# Altium project 风扇_V1.5.PrjPCB
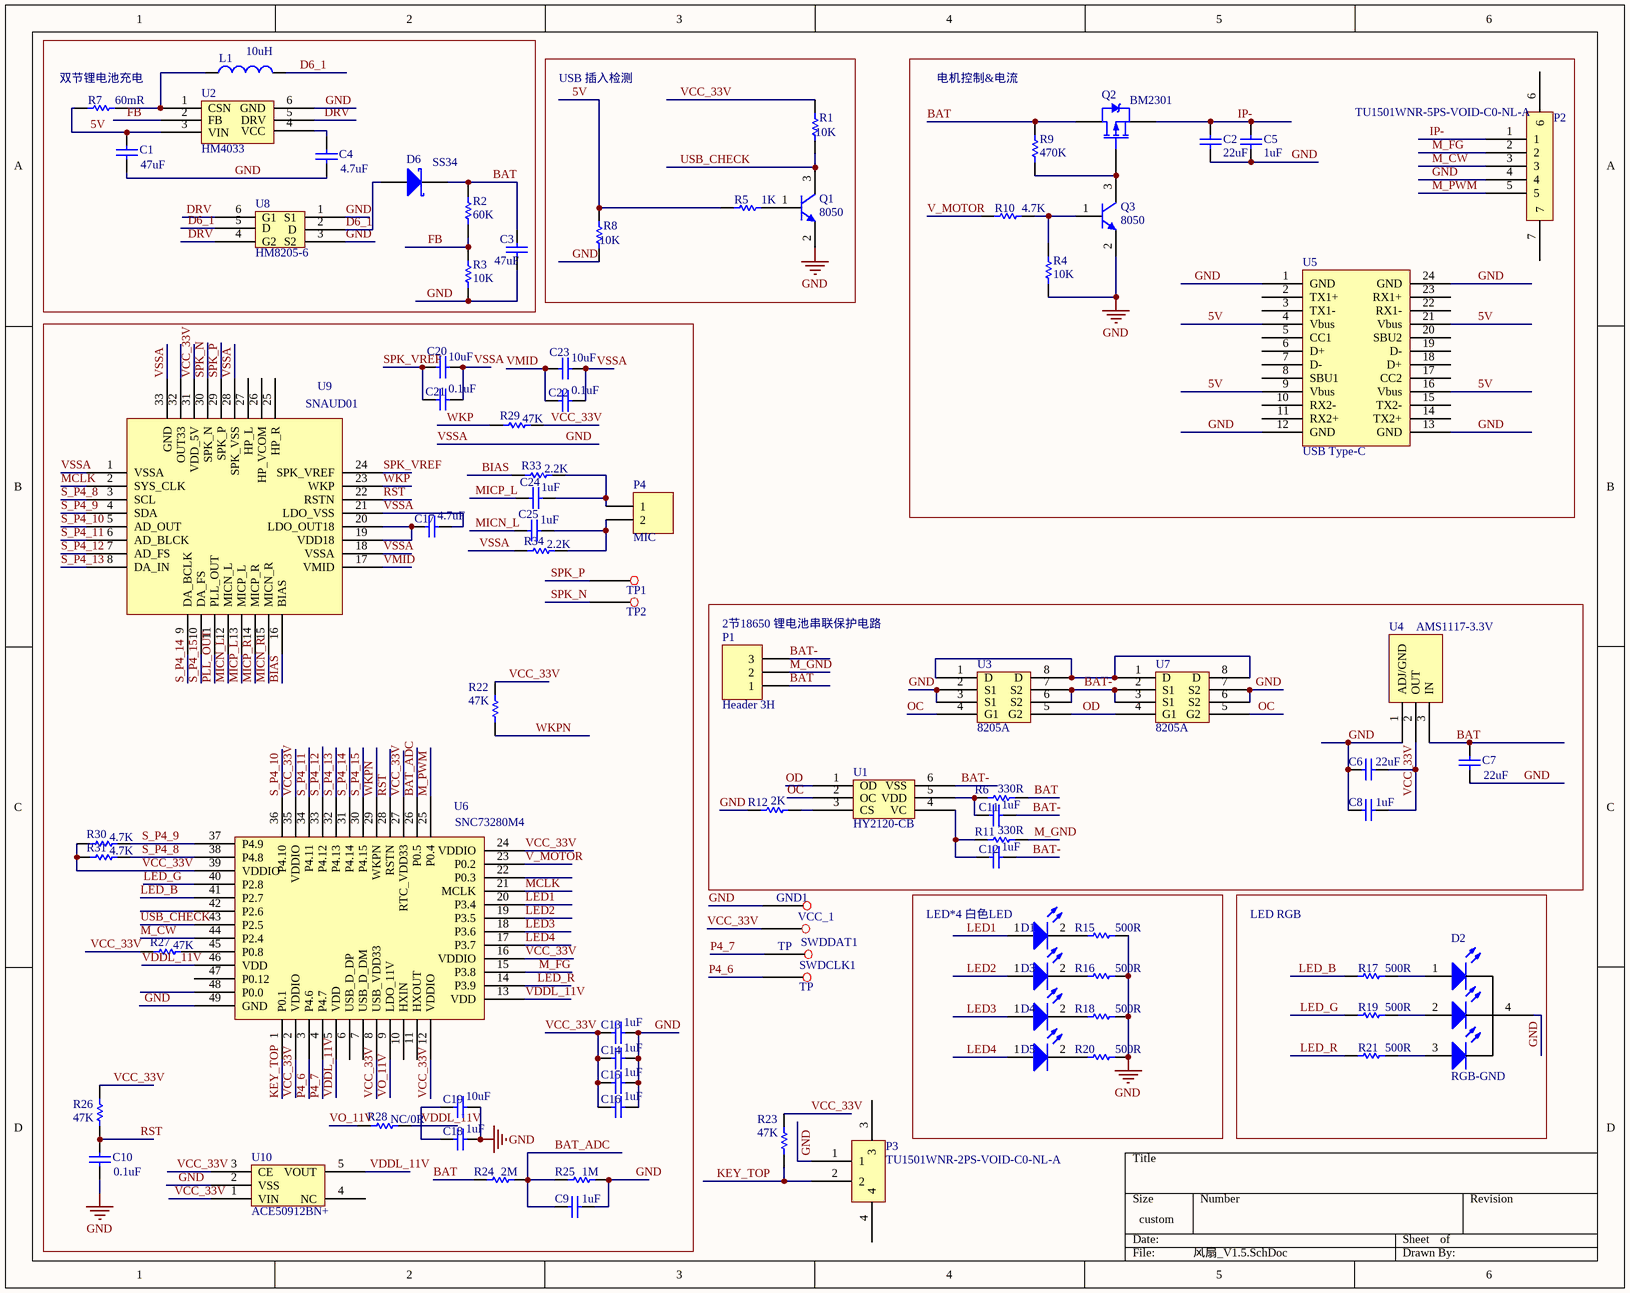
[diagram p0: 风扇_V1.5.SchDoc]
1 sheet, 86 parts. Net scope: global (net labels, ports and power ports of the same name join across sheets).
Board file: 风扇_V1.5.PcbDoc

## Sheet 风扇_V1.5.SchDoc: 风扇-衣架
size 304 x 241 mm

### Parts
C1  47uF  [C-0603]
C2  22uF  [C-0603]
C3  47uF  [C-0603]
C4  4.7uF  [C-0402]
C5  1uF  [C-0402]
C6  22uF  [C-0603]
C7  22uF  [C-0603]
C8  1uF  [C-0402]
C9  1uF  [C-0402]
C10  0.1uF  [C-0402]
C11  1uF  [C-0402]
C12  1uF  [C-0402]
C13  1uF  [C-0402]
C14  1uF  [C-0402]
C15  1uF  [C-0402]
C16  1uF  [C-0402]
C17  4.7uF  [C-0402]
C18  1uF  [C-0402]
C19  10uF  [C-0402]
C20  10uF  [C-0402]
C21  0.1uF  [C-0402]
C22  0.1uF  [C-0402]
C23  10uF  [C-0402]
C24  1uF  [C-0402]
C25  1uF  [C-0402]
D1  LED0  [LED-0603]  (value not drawn)
D2  RGB-GND  [0603*2-LED]
D3  LED0  [LED-0603]  (value not drawn)
D4  LED0  [LED-0603]  (value not drawn)
D5  LED0  [LED-0603]  (value not drawn)
D6  SS34  [DSMD]
GND1  TP  [TP-1.5]  (value not drawn)
L1  10uH  [L-SMD]
P1  Header 3H  [3P-SMT-3*3]
P2  TU1501WNR-5PS-VOID-C0-NL-A  [TU1501WNR-5PS-VOID-*-NL-A]
P3  TU1501WNR-2PS-VOID-C0-NL-A  [TU1501WNR-2PS-VOID-*-NL-A]
P4  MIC  [HDR1X2]
Q1  8050  [SOT-23]
Q2  BM2301  [SOT-23]
Q3  8050  [SOT-23]
R1  10K  [R-0402]
R2  60K  [R-0402]
R3  10K  [R-0402]
R4  10K  [R-0402]
R5  1K  [R-0402]
R6  330R  [R-0402]
R7  60mR  [R-0402]
R8  10K  [R-0402]
R9  470K  [R-0402]
R10  4.7K  [R-0402]
R11  330R  [R-0402]
R12  2K  [R-0402]
R15  500R  [R-0402]
R16  500R  [R-0402]
R17  500R  [R-0402]
R18  500R  [R-0402]
R19  500R  [R-0402]
R20  500R  [R-0402]
R21  500R  [R-0402]
R22  47K  [R-0402]
R23  47K  [R-0402]
R24  2M  [R-0402]
R25  1M  [R-0402]
R26  47K  [R-0402]
R27  47K  [R-0402]
R28  NC/0R  [R-0402]
R29  47K  [R-0402]
R30  4.7K  [R-0402]
R31  4.7K  [R-0402]
R33  2.2K  [R-0402]
R34  2.2K  [R-0402]
SWDCLK1  TP  [TP-1.5]
SWDDAT1  TP  [TP-1.5]
TP1  TP  [TP-1]  (value not drawn)
TP2  TP  [TP-1]  (value not drawn)
U1  HY2120-CB  [SOT-23-6L]
U2  HM4033  [SOT-23-6L]
U3  8205A  [TSSOP8]
U4  AMS1117-3.3V  [SOT-223]
U5  USB Type-C  [USB-type C]
U6  SNC73280M4  [QFN48-7*7]
U7  8205A  [TSSOP8]
U8  HM8205-6  [SOT-23-6L]
U9  SNAUD01  [QFN32_AUDO01]
U10  ACE50912BN+  [SOT-23-5]
VCC_1  TP  [TP-1.5]  (value not drawn)

### Blocks framed on the sheet
双节锂电池充电: C1 C3 C4 D6 L1 R2 R3 R7 U2 U8
USB 插入检测: Q1 R1 R5 R8
电机控制&电流: C2 C5 P2 Q2 Q3 R4 R9 R10 U5
2节18650 锂电池串联保护电路: C6-C8 C11 C12 P1 R6 R11 R12 U1 U3 U4 U7
LED*4 白色LED: D1 D3-D5 R15 R16 R18 R20
LED RGB: D2 R17 R19 R21

### Nets
GND: C1.2 C2.1 C3.1 C4.2 C5.1 C6.1 C7.1 C8.1 C9.1 C10.1 C13.1 C14.1 C15.1 C16.1 C17.1 C18.1 C19.1 C20.1 C21.1 C22.1 C23.1 D2.4 GND1.1 P2.4 P3.1 Q1.2(E) Q3.2(E) R3.2 R4.1 R8.2 R12.1 R15.2 R16.2 R18.2 R20.2 R25.2 R34.2 U2.6(GND) U3.2(S1) U3.3(S1) U4.1(ADJ/GND) U5.1(GND) U5.12(GND) U5.13(GND) U5.24(GND) U6.49(GND) U7.6(S2) U7.7(S2) U8.1(S1) U8.3(S2) U9.1(VSSA) U9.18(VSSA) U9.21(LDO_VSS) U9.28(SPK_VSS) U9.33(GND) U10.2(VSS)  [also labelled VSSA]
5V: C1.1 R5.1 R7.2 R8.1 U2.3(VIN) U5.4(Vbus) U5.9(Vbus) U5.16(Vbus) U5.21(Vbus)
BAT: C3.2 C7.2 D6.1(K) P1.1 Q2.2(D) R2.1 R6.2 R9.2 R24.1 U4.3(IN)
BAT-: C11.1 C12.1 P1.3 U1.6(VSS) U3.6(S2) U3.7(S2) U7.2(S1) U7.3(S1)
BAT_ADC: C9.2 R24.2 R25.1 U6.26(P0.5)
BIAS: R33.2 U9.16(BIAS)
D6_1: D6.3(A) L1.2 U8.2(D) U8.5(D)
DRV: U2.5(DRV) U8.4(G2) U8.6(G1)
FB: R2.2 R3.1 U2.2(FB)
IP-: C2.2 C5.2 P2.1 Q2.3(S)
KEY_TOP: P3.2 R23.1 U6.1(P0.1)
LED1: D1.1(A) U6.20(P3.4)
LED2: D3.1(A) U6.19(P3.5)
LED3: D4.1(A) U6.18(P3.6)
LED4: D5.1(A) U6.17(P3.7)
LED_B: R17.1 U6.41(P2.7)
LED_G: R19.1 U6.40(P2.8)
LED_R: R21.1 U6.14(P3.9)
M_CW: P2.3 U6.44(P2.4)
M_FG: P2.2 U6.15(P3.8)
M_GND: P1.2 R11.2
M_PWM: P2.5 U6.25(P0.4)
MCLK: U6.21(MCLK) U9.2(SYS_CLK)
MICN_L: C25.2 U9.12(MICN_L)
MICN_R: U9.15(MICN_R)
MICP_L: C24.2 U9.13(MICP_L)
MICP_R: U9.14(MICP_R)
OC: U1.2(OC) U3.4(G1) U7.5(G2)
OD: U1.1(OD) U3.5(G2) U7.4(G1)
P4_6: SWDCLK1.1 U6.3(P4.6)
P4_7: SWDDAT1.1 U6.4(P4.7)
PLL_OUT: U9.11(PLL_OUT)
RST: C10.2 R26.1 U6.28(RSTN) U9.22(RSTN)
S_P4_8: R31.1 U6.38(P4.8) U9.3(SCL)
S_P4_9: R30.1 U6.37(P4.9) U9.4(SDA)
S_P4_10: U6.36(P4.10) U9.5(AD_OUT)
S_P4_11: U6.34(P4.11) U9.6(AD_BLCK)
S_P4_12: U6.33(P4.12) U9.7(AD_FS)
S_P4_13: U6.32(P4.13) U9.8(DA_IN)
S_P4_14: U6.31(P4.14) U9.9(DA_BCLK)
S_P4_15: U6.30(P4.15) U9.10(DA_FS)
SPK_N: TP2.?1 U9.30(SPK_N)
SPK_P: TP1.?1 U9.29(SPK_P)
SPK_VREF: C20.2 C21.2 U9.24(SPK_VREF)
USB_CHECK: Q1.3(C) R1.1 U6.43(P2.5)
V_MOTOR: R10.1 U6.23(P0.2)
VCC_33V: C6.2 C8.2 C13.2 C14.2 C15.2 C16.2 R1.2 R22.2 R23.2 R26.2 R27.2 R29.1 R30.2 R31.2 U4.2(OUT) U6.2(VDDIO) U6.8(USB_VDD33) U6.12(VDDIO) U6.16(VDDIO) U6.24(VDDIO) U6.27(RTC_VDD33) U6.35(VDDIO) U6.39(VDDIO) U9.31(VDD_5V) U10.1(VIN) U10.3(CE) VCC_1.1
VDDL_11V: C18.2 C19.2 R28.1 U6.5(VDD) U6.13(VDD) U6.46(VDD) U10.5(VOUT)
VMID: C22.2 C23.2 U9.17(VMID)
VO_11V: R28.2 U6.9(LDO_11V)
WKP: R29.2 U9.23(WKP)
WKPN: R22.1 U6.29(WKPN)
NetC4_1: C4.1 U2.4(VCC)
NetC11_2: C11.2 R6.1 U1.5(VDD)
NetC12_2: C12.2 R11.1 U1.4(VC)
NetC17_2: C17.2 U9.19(VDD18) U9.20(LDO_OUT18)
NetC24_1: C24.1 P4.1 R33.1
NetC25_1: C25.1 P4.2 R34.1
NetD1_2: D1.2(K) R15.1
NetD2_1: D2.1 R17.2
NetD2_2: D2.2 R19.2
NetD2_3: D2.3 R21.2
NetD3_2: D3.2(K) R16.1
NetD4_2: D4.2(K) R18.1
NetD5_2: D5.2(K) R20.1
NetL1_1: L1.1 R7.1 U2.1(CSN)
NetQ1_1: Q1.1(B) R5.2
NetQ2_1: Q2.1(G) Q3.3(C) R9.1
NetQ3_1: Q3.1(B) R4.2 R10.2
NetR12_2: R12.2 U1.3(CS)
NetR27_1: R27.1 U6.45(P0.8)
NetU3_1: U3.1(D) U3.8(D) U7.1(D) U7.8(D)

Not connected (* = marked no-connect by the designer): P2 6 7; P3 3 4; U5 2(TX1+) 3(TX1-) 5(CC1) 6(D+) 7(D-) 8(SBU1) 10(RX2-) 11(RX2+) 14(TX2+) 15(TX2-) 17(CC2) 18(D+) 19(D-) 20(SBU2) 22(RX1-) 23(RX1+); U6 6(USB_D_DP) 7(USB_D_DM) 10(HXIN) 11(HXOUT) 22(P0.3) 42(P2.6) 47(P0.12) 48(P0.0); U9 25(HP_R) 26(HP_VCOM) 27(HP_L) 32(OUT33); U10 4(NC)

### Library data of the parts
C1 = Cap: Capacitor; Value: 10uF; Published: 8-Jun-2000; LatestRevisionDate: 17-Jul-2002; LatestRevisionNote: Re-released for DXP Platform.; PackageReference: RAD-0.3; Publisher: Altium Limited
C2 C5-C25 = Cap: Capacitor; Published: 8-Jun-2000; LatestRevisionDate: 17-Jul-2002; LatestRevisionNote: Re-released for DXP Platform.; PackageReference: RAD-0.3; Publisher: Altium Limited
  C2 C5 C10-C25: PackageDescription: Radial Cap, Thru-Hole; 2 Leads; 0.3 in Pin Spacing
  C6 C7: Value: 22uF
  C8 C9: Value: 1uF
C3 = Cap: Capacitor; Value: 47nF; Published: 8-Jun-2000; LatestRevisionDate: 17-Jul-2002; LatestRevisionNote: Re-released for DXP Platform.; PackageReference: RAD-0.3; Publisher: Altium Limited
C4 = Cap: Capacitor; Value: 22uF; Published: 8-Jun-2000; LatestRevisionDate: 17-Jul-2002; LatestRevisionNote: Re-released for DXP Platform.; PackageReference: RAD-0.3; Publisher: Altium Limited
D1 D3-D5 = LED0: Typical INFRARED GaAs LED; Published: 8-Jun-2000; LatestRevisionDate: 08-Jul-2005; LatestRevisionNote: Mech Layer 1 removed.; PackageReference: LED-0; Publisher: Altium Limited
D6 = Diode 10TQ035: Schottky Rectifier; Note: Terminal 2 is the TAB and is electrically connected to the cathode; Published: 8-Jun-2000; LatestRevisionDate: 17-Jul-2002; LatestRevisionNote: Re-released for DXP Platform.; DatasheetVersion: PD-2.057B; PackageVersion: Feb-1998; PackageReference: TO-220AC; Publisher: Altium Limited; ComponentLink1Description: Manufacturer Link; ComponentLink1URL: http://www.irf.com/; ComponentLink2Description: Datasheet; ComponentLink2URL: http://www.irf.com/product-info/datasheets/data/10tq.pdf
L1 = Inductor: Code_IEC: 1005; Value: 4.7uH; Published: 8-Jun-2000; LatestRevisionDate: 29-May-2009; LatestRevisionNote: IPC-7351 Footprint Added.; PackageReference: 0402-A; Publisher: Altium Limited; PackageDescription: Chip Inductor; Code_JEITA: 0402
P1 = Header 3H: Header, 3-Pin, Right Angle; LatestRevisionDate: 17-Jul-2002; LatestRevisionNote: Re-released for DXP Platform.; Publisher: Altium Limited
P4 = Header 2: Header, 2-Pin; LatestRevisionDate: 17-Jul-2002; LatestRevisionNote: Re-released for DXP Platform.; Publisher: Altium Limited
Q1 Q3 = NPN: NPN Bipolar Transistor; Published: 8-Jun-2000; LatestRevisionDate: 17-Jul-2002; LatestRevisionNote: Re-released for DXP Platform.; PackageReference: TO-226-AA; Publisher: Altium Limited; PackageDescription: TO, Flat Index; 3 In-Line, Axial Leads; Body Dia. 4.8mm; Leads 0.55 x 0.51 mm (max); Code_JEDEC: TO-226-AA
Q2 = PMOS-2: P-Channel Power MOSFET; Note: Pin 4 not drawn and electrically connected to Pin 2.; Published: 8-Jun-2000; LatestRevisionDate: 17-Jul-2002; LatestRevisionNote: Re-released for DXP Platform.; DatasheetVersion: PD-9.390D; PackageReference: TO-220AB; Publisher: Altium Limited; Code_JEDEC: TO-220-AB; ComponentLink1Description: Manufacturer Link; ComponentLink1URL: http://www.irf.com/
R1 R4 R5 R8-R10 R15-R23 R25-R27 R29 = Res1: Resistor; Published: 8-Jun-2000; LatestRevisionDate: 17-Jul-2002; LatestRevisionNote: Re-released for DXP Platform.; PackageReference: AXIAL-0.3; Publisher: Altium Limited
  R1 R4 R5 R9 R10 R17 R19 R21 R26: PackageDescription: Axial Device, Thru-Hole; 2 Leads; 0.3 in Pin Spacing
  R8: Value: 10K
  R15 R16 R18 R20: Value: 500R
  R22 R23 R27 R29: PackageDescription: Axial Device, Thru-Hole; 2 Leads; 0.3 in Pin Spacing; Value: 47K
  R25: Value: 1M
R2 = Res1: Resistor; Value: 1K; Published: 8-Jun-2000; LatestRevisionDate: 17-Jul-2002; LatestRevisionNote: Re-released for DXP Platform.; PackageReference: AXIAL-0.3; Publisher: Altium Limited
R3 = Res1: Resistor; Value: 3.9K; Published: 8-Jun-2000; LatestRevisionDate: 17-Jul-2002; LatestRevisionNote: Re-released for DXP Platform.; PackageReference: AXIAL-0.3; Publisher: Altium Limited
R6 R11 R12 = Res1: Resistor; Value: 3.3K; Published: 8-Jun-2000; LatestRevisionDate: 17-Jul-2002; LatestRevisionNote: Re-released for DXP Platform.; PackageReference: AXIAL-0.3; Publisher: Altium Limited
R7 = Res1: Resistor; Value: 50mR; Published: 8-Jun-2000; LatestRevisionDate: 17-Jul-2002; LatestRevisionNote: Re-released for DXP Platform.; PackageReference: AXIAL-0.3; Publisher: Altium Limited
R24 = Res1: Resistor; Value: 1M; Published: 8-Jun-2000; LatestRevisionDate: 17-Jul-2002; LatestRevisionNote: Re-released for DXP Platform.; PackageReference: AXIAL-0.3; Publisher: Altium Limited
R28 R30 R31 R33 R34 = Res1: Resistor; Value: 47K; Published: 8-Jun-2000; LatestRevisionDate: 17-Jul-2002; LatestRevisionNote: Re-released for DXP Platform.; PackageReference: AXIAL-0.3; Publisher: Altium Limited; PackageDescription: Axial Device, Thru-Hole; 2 Leads; 0.3 in Pin Spacing
U1 = HY2120
U4 = AMS1117